# Altium schematic sheet 501_GridPos5.SchDoc
size A2; Organization: Greenfield Tech Solutions; Address1: Molendreef 33; Address2: Ossendrecht; Address3: 4641CS; Address4: The Netherlands; SheetNumber: 4; SheetTotal: 4
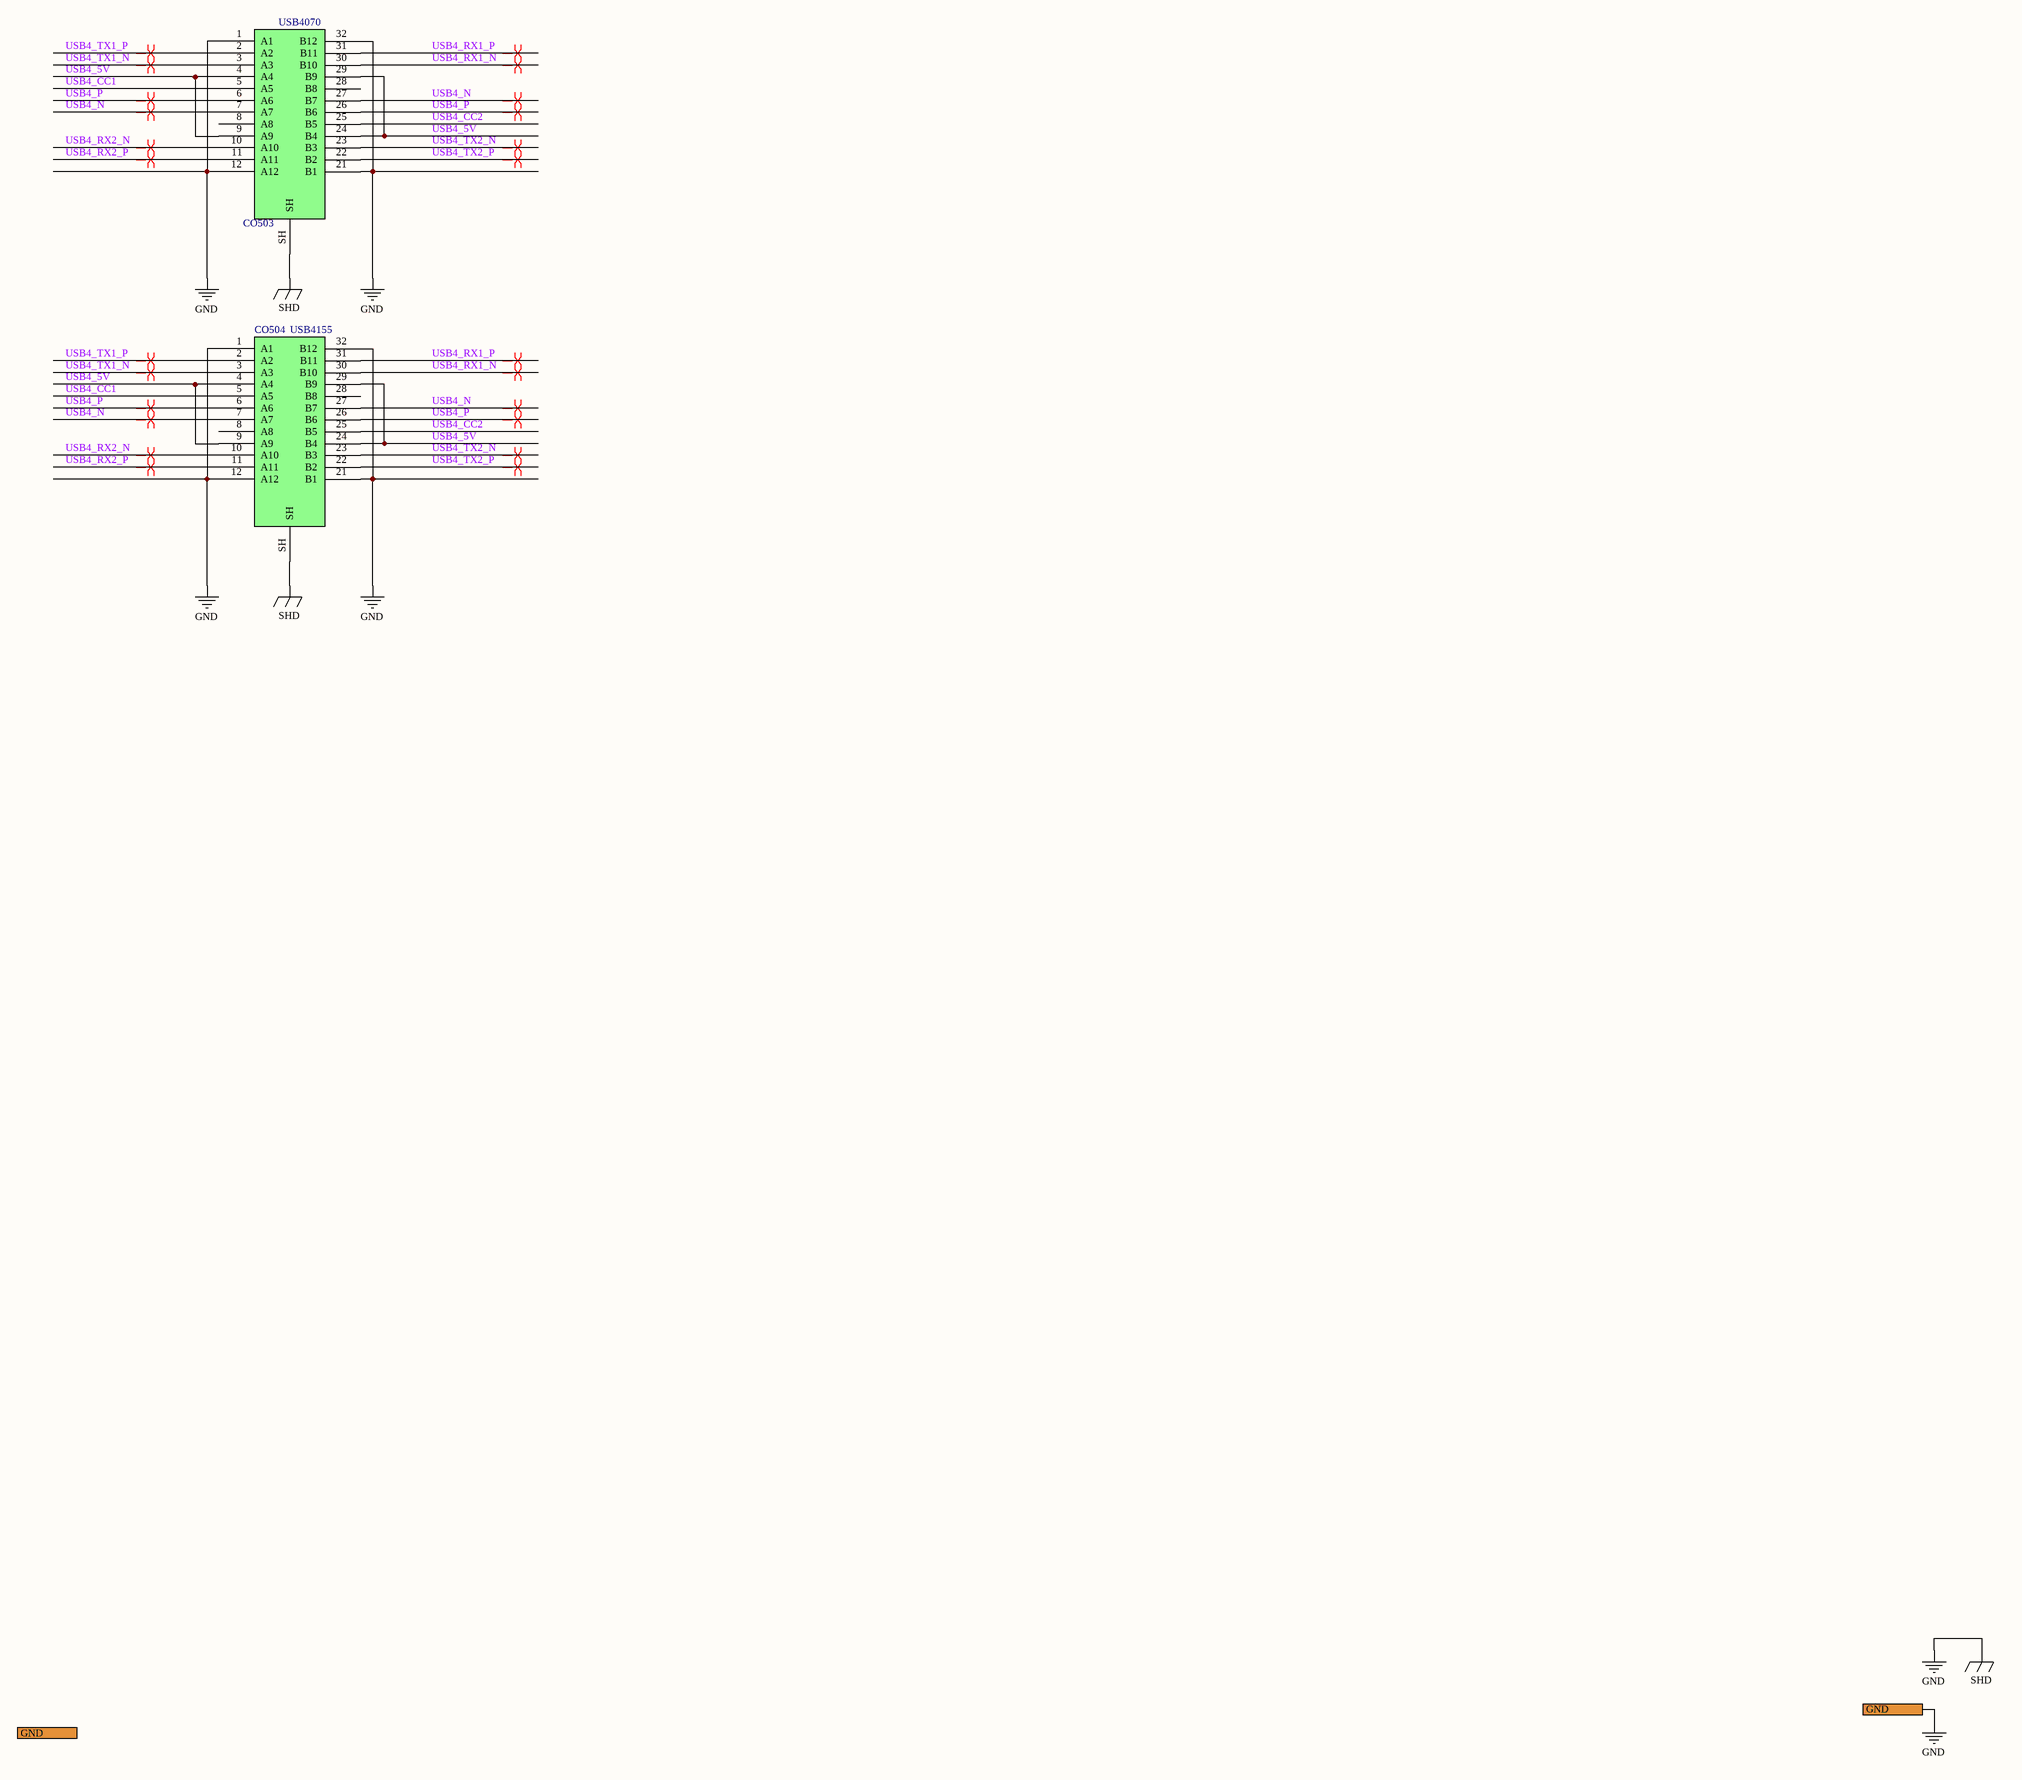
[diagram p0: 501_GridPos5.SchDoc]

## Parts
CO503  USB4070  [USB4070-30-C]
CO504  USB4155  [USB4155-03-C]

## Ports
GND

## Nets
GND: CO503.1(A1) CO503.12(A12) CO503.21(B1) CO503.32(B12) CO503.SH CO504.1(A1) CO504.12(A12) CO504.21(B1) CO504.32(B12) CO504.SH ; port GND  [also labelled SHD]
USB4_5V: CO503.4(A4) CO503.9(A9) CO503.24(B4) CO503.29(B9) CO504.4(A4) CO504.9(A9) CO504.24(B4) CO504.29(B9)
USB4_CC1: CO503.5(A5) CO504.5(A5)
USB4_CC2: CO503.25(B5) CO504.25(B5)
USB4_N: CO503.7(A7) CO503.27(B7) CO504.7(A7) CO504.27(B7)
USB4_P: CO503.6(A6) CO503.26(B6) CO504.6(A6) CO504.26(B6)
USB4_RX1_N: CO503.30(B10) CO504.30(B10)
USB4_RX1_P: CO503.31(B11) CO504.31(B11)
USB4_RX2_N: CO503.10(A10) CO504.10(A10)
USB4_RX2_P: CO503.11(A11) CO504.11(A11)
USB4_TX1_N: CO503.3(A3) CO504.3(A3)
USB4_TX1_P: CO503.2(A2) CO504.2(A2)
USB4_TX2_N: CO503.23(B3) CO504.23(B3)
USB4_TX2_P: CO503.22(B2) CO504.22(B2)

Not connected (* = marked no-connect by the designer): CO503 8(A8) 28(B8); CO504 8(A8) 28(B8)

## Layout directives
differential pair; differential pair class USB3: USB4_N, USB4_P, USB4_RX1_N, USB4_RX1_P, USB4_RX2_N, USB4_RX2_P, USB4_TX1_N, USB4_TX1_P, USB4_TX2_N, USB4_TX2_P

## Notes on the sheet
- Title
- Size:
- Date:
- File:
- A2
- Number:
- Time:
- Revision:
- Sheet
- of

## Library data of the parts
CO503 = CO0021: USB C connector Receptacle Vertical; Part Number: CO0021; ID: 16; RefVal: USB4070; ManfactPart: USB4070-30-C
CO504 = CO0031: USB C connector Plug Horizontal; Part Number: CO0031; ID: 30; RefVal: USB4155; ManfactPart: USB4155-03-C